# Altium schematic sheet ESP32_LED_Matrix.SchDoc
size A4; SheetNumber: 1; SheetTotal: 5
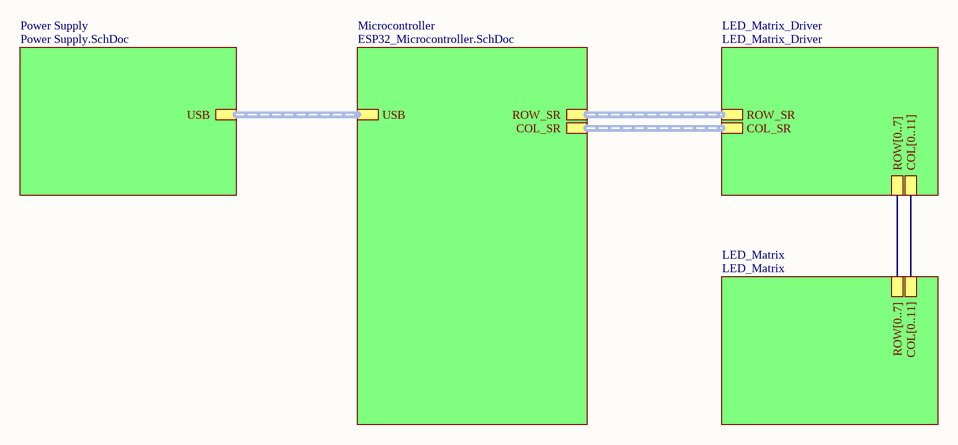
[diagram p0: ESP32_LED_Matrix.SchDoc]

## Sub-sheets
LED_Matrix = LED_Matrix: COL[0..11], ROW[0..7]
LED_Matrix_Driver = LED_Matrix_Driver: COL_SR (harness COL_SR), ROW_SR (harness ROW_SR), ROW[0..7], COL[0..11]
Microcontroller = ESP32_Microcontroller.SchDoc: COL_SR (harness COL_SR), ROW_SR (harness ROW_SR), USB (harness USB)
Power Supply = Power Supply.SchDoc: USB (harness USB)

## Buses and harness runs
bus sheet LED_Matrix/COL[0..11] = sheet LED_Matrix_Driver/COL[0..11]
bus sheet LED_Matrix/ROW[0..7] = sheet LED_Matrix_Driver/ROW[0..7]
harness sheet LED_Matrix_Driver/COL_SR = sheet Microcontroller/COL_SR
harness sheet LED_Matrix_Driver/ROW_SR = sheet Microcontroller/ROW_SR
harness sheet Microcontroller/USB = sheet Power Supply/USB